# EAGLE design P2H2-001 (EAGLE 7.1.0)
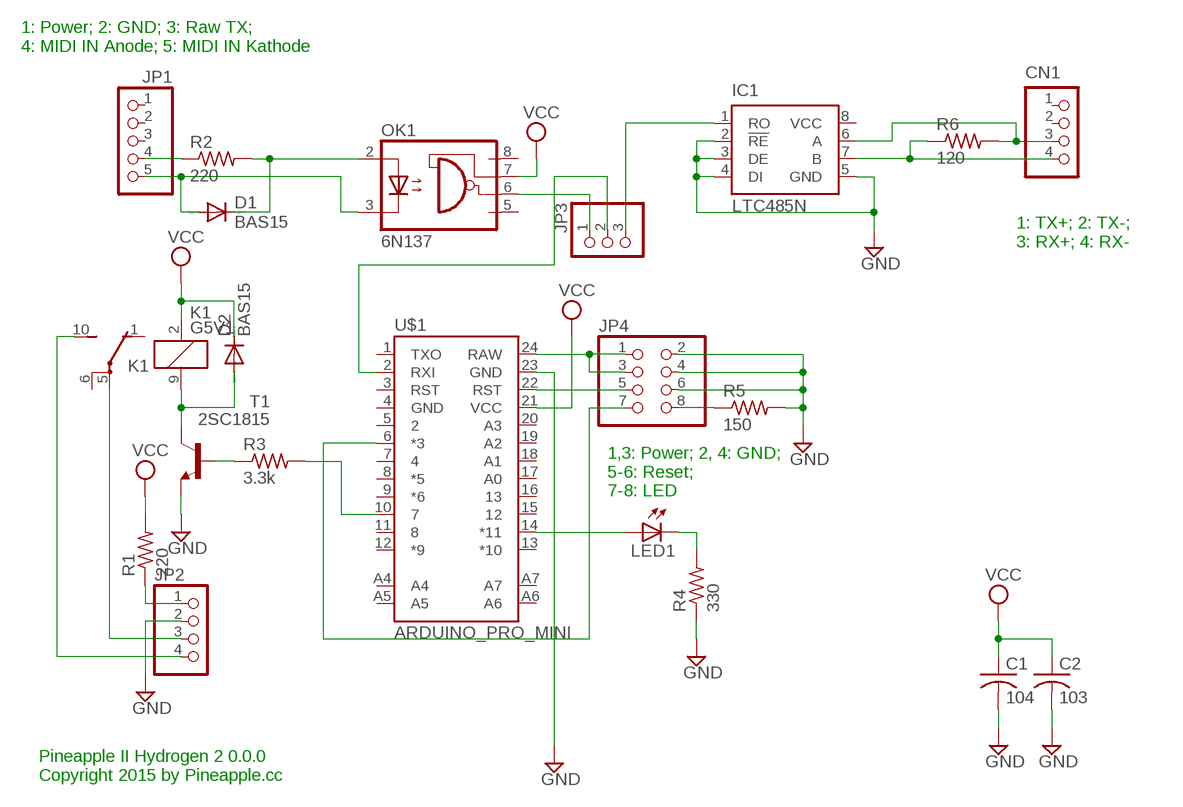
[diagram p0: schematic, sheet 1]

## Parts
C1  104  C-US025-025X050  [C025-025X050]
C2  103  C-US025-025X050  [C025-025X050]
CN1  B4B-PH-K-S  [B4B-PH-K-S]
D1  BAS15  [DO34-7]
D2  BAS15  [DO34-7]
IC1  LTC485N  [DIL08]
JP1  PINHD-1X5  [1X05]
JP2  PINHD-1X4  [1X04]
JP3  PINHD-1X3  [1X03]
JP4  PINHD-2X4  [2X04]
K1  G5V1  [G5V1]
LED1  LED3MM  [LED3MM]
OK1  6N137  [DIL08]
R1  220  R-US_0204/5  [0204/5]
R2  220  R-US_0204/5  [0204/5]
R3  3.3k  R-US_0204/5  [0204/5]
R4  330  R-US_0204/5  [0204/5]
R5  150  R-US_0204/5  [0204/5]
R6  120  R-US_0204/5  [0204/5]
T1  2SC1815  [TO92-ECB]
U$1  ARDUINO_PRO_MINI  [ARDUINO_PRO_MINI]

## Nets
GND: C1.2 C2.2 IC1.2(!RE) IC1.3(DE) IC1.4(DI) IC1.5(GND) JP2.2 JP4.2 JP4.4 JP4.6 R4.1 R5.2 T1.E U$1.23(GND)
N$1: R3.2 U$1.10
N$2: CN1.3 IC1.6(A) R6.2
N$3: JP1.4 R2.1
N$4: D1.C OK1.2(A) R2.2
N$5: JP4.8 R5.1
N$6: JP4.5 U$1.22(RST)
N$7: D1.A JP1.5 OK1.3(C)
N$8: JP4.7 U$1.6(*3)
N$9: JP4.1 JP4.3 U$1.24(RAW)
N$10: JP2.1 R1.1
N$11: CN1.4 IC1.7(B) R6.1
N$12: JP3.1 OK1.6(VO)
N$13: R3.1 T1.B
N$14: IC1.1(RO) JP3.3
N$15: D2.A K1.9 T1.C
N$16: LED1.A U$1.14(*11)
N$17: LED1.K(C) R4.2
N$18: JP2.3 K1.5(2:P)
N$19: JP2.4 K1.10(2:S)
N$20: JP3.2 U$1.2(RXI)
VCC: C1.1 C2.1 D2.C K1.2 OK1.7(VE) R1.2 U$1.21(VCC)
Unconnected: CN1.1 CN1.2 IC1.8(VCC) JP1.1 JP1.2 JP1.3 K1.1(2:O) K1.6(2:P) OK1.5(GND) OK1.8(VCC) U$1.1(TXO) U$1.3(RST) U$1.4(GND) U$1.5 U$1.7 U$1.8(*5) U$1.9(*6) U$1.11 U$1.12(*9) U$1.13(*10) U$1.15 U$1.16 U$1.17(A0) U$1.18(A1) U$1.19(A2) U$1.20(A3) U$1.A4 U$1.A5 U$1.A6 U$1.A7

## Notes on the sheet
- 1: Power; 2: GND; 3: Raw TX;
  4: MIDI IN Anode; 5: MIDI IN Kathode
- 1: TX+; 2: TX-;
  3: RX+; 4: RX-
- 1,3: Power; 2, 4: GND;
  5-6: Reset;
  7-8: LED
- Pineapple II Hydrogen 2 0.0.0
  Copyright 2015 by Pineapple.cc

## Library data of the parts
C1 C2 = rcl:C-US: CAPACITOR, American symbol
CN1 = jst-ph:B4B-PH-*: Wire-to-Board 2.0mm pitch top mount connector Source: http://www.jst-mfg.com/product/pdf/jpn/PH.pdf http://www.jst-mfg.com/product/detail.php?series=199
D1 D2 = diode:BAS15: DIODE high speed
IC1 = linear-technology:LTC485: Low Power RS485 Interface Transceiver Source: http://www.linear.com/pc/downloadDocument.do?navId=H0,C1,C1007,C1017,P2064,D1718; OC_FARNELL: unknown; OC_NEWARK: unknown
JP1 = pinhead:PINHD-1X5: PIN HEADER
JP2 = pinhead:PINHD-1X4: PIN HEADER
JP3 = pinhead:PINHD-1X3: PIN HEADER
JP4 = pinhead:PINHD-2X4: PIN HEADER
K1 = relay:G5V1: RELAY 1 x switch, 0.5 A/125 V AC, 1 A/24 V DC , Omron; MPN: G5V-1-DC24; OC_FARNELL: 9949593; OC_NEWARK: 36M6377
LED1 = led:LED: LED OSRAM: - CHIPLED LG R971, LG N971, LY N971, LG Q971, LY Q971, LO R971, LY R971 LH N974, LH R974 LS Q976, LO Q976, LY Q976 LO Q996 - Hyper CHIPLED LW Q18S LB Q993, LB Q99A, LB R99A - SideLED LS A670, LO A670, LY A670, LG A670, LP A670 LB A673, LV A673, LT A673, LW A673 LH A674 LY A675 LS A676, LA A676, LO A676, LY A676, LW A676 LS A679, LY A679, LG A679 - Hyper Micro SIDELED® LS Y876, LA Y876, LO Y876, LY Y876 LT Y87S - SmartLED LW L88C, LW L88S LB L89C, LB L89S, LG L890 LS L89K, LO L89K, LY L89K LS L896, LA L896, LO L896, LY L896 - TOPLED LS T670, LO T670, LY T670, LG T670, LP T670 LSG T670, LSP T670, LSY T670, LOP T670, LYG T670 LG T671, LOG T671, LSG T671 LB T673, LV T673, LT T673, LW T673 LH T674 LS T676, LA T676, LO T676, LY T676, LB T676, LH T676, LSB T676, LW T676 LB T67C, LV T67C, LT T67C, LS T67K, LO T67K, LY T67K, LW E67C LS E67B, LA E67B, LO E67B, LY E67B, LB E67C, LV E67C, LT E67C LW T67C LS T679, LY T679, LG T679 LS T770, LO T770, LY T770, LG T770, LP T770 LB T773, LV T773, LT T773, LW T773 LH T774 LS E675, LA E675, LY E675, LS T675 LS T776, LA T776, LO T776, LY T776, LB T776 LHGB T686 LT T68C, LB T68C - Hyper Mini TOPLED® LB M676 - Mini TOPLED Santana® LG M470 LS M47K, LO M47K, LY M47K Source: http://www.osram.convergy.de LUXEON: - LUMILED® LXK2-PW12-R00, LXK2-PW12-S00, LXK2-PW14-U00, LXK2-PW14-V00 LXK2-PM12-R00, LXK2-PM12-S00, LXK2-PM14-U00 LXK2-PE12-Q00, LXK2-PE12-R00, LXK2-PE12-S00, LXK2-PE14-T00, LXK2-PE14-U00 LXK2-PB12-K00, LXK2-PB12-L00, LXK2-PB12-M00, LXK2-PB14-N00, LXK2-PB14-P00, LXK2-PB14-Q00 LXK2-PR12-L00, LXK2-PR12-M00, LXK2-PR14-Q00, LXK2-PR14-R00 LXK2-PD12-Q00, LXK2-PD12-R00, LXK2-PD12-S00 LXK2-PH12-R00, LXK2-PH12-S00 LXK2-PL12-P00, LXK2-PL12-Q00, LXK2-PL12-R00 Source: www.luxeon.com KINGBRIGHT: KA-3528ASYC Source: www.kingbright.com
OK1 = optocoupler:6N137: MOTOROLA OPTO COUPLER; MPN: 6N137; OC_FARNELL: 1328376; OC_NEWARK: 52M1895
R1-R6 = resistor:R-US_: RESISTOR, American symbol
T1 = transistor:2SC1815: NPN EPITAXIAL TRANSISTOR Source: TOSHIBA .. 2SC1815 1.pdf
U$1 = SparkFun-Boards:ARDUINO_PRO_MINI

## Board
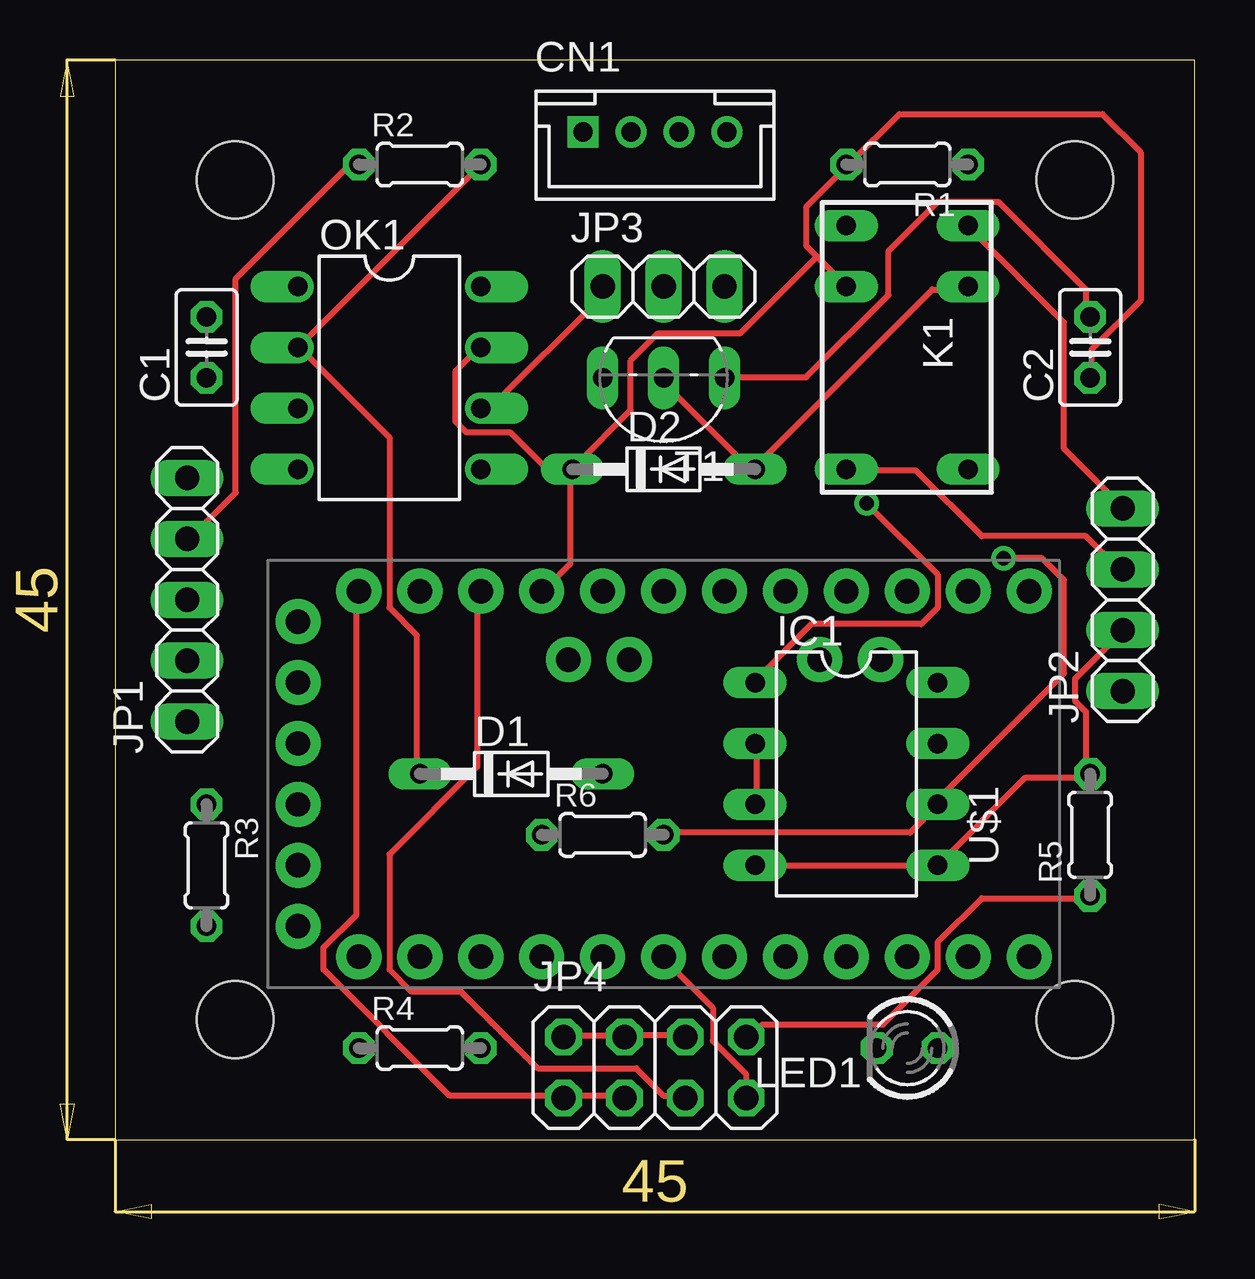
[diagram p1: board, top side]
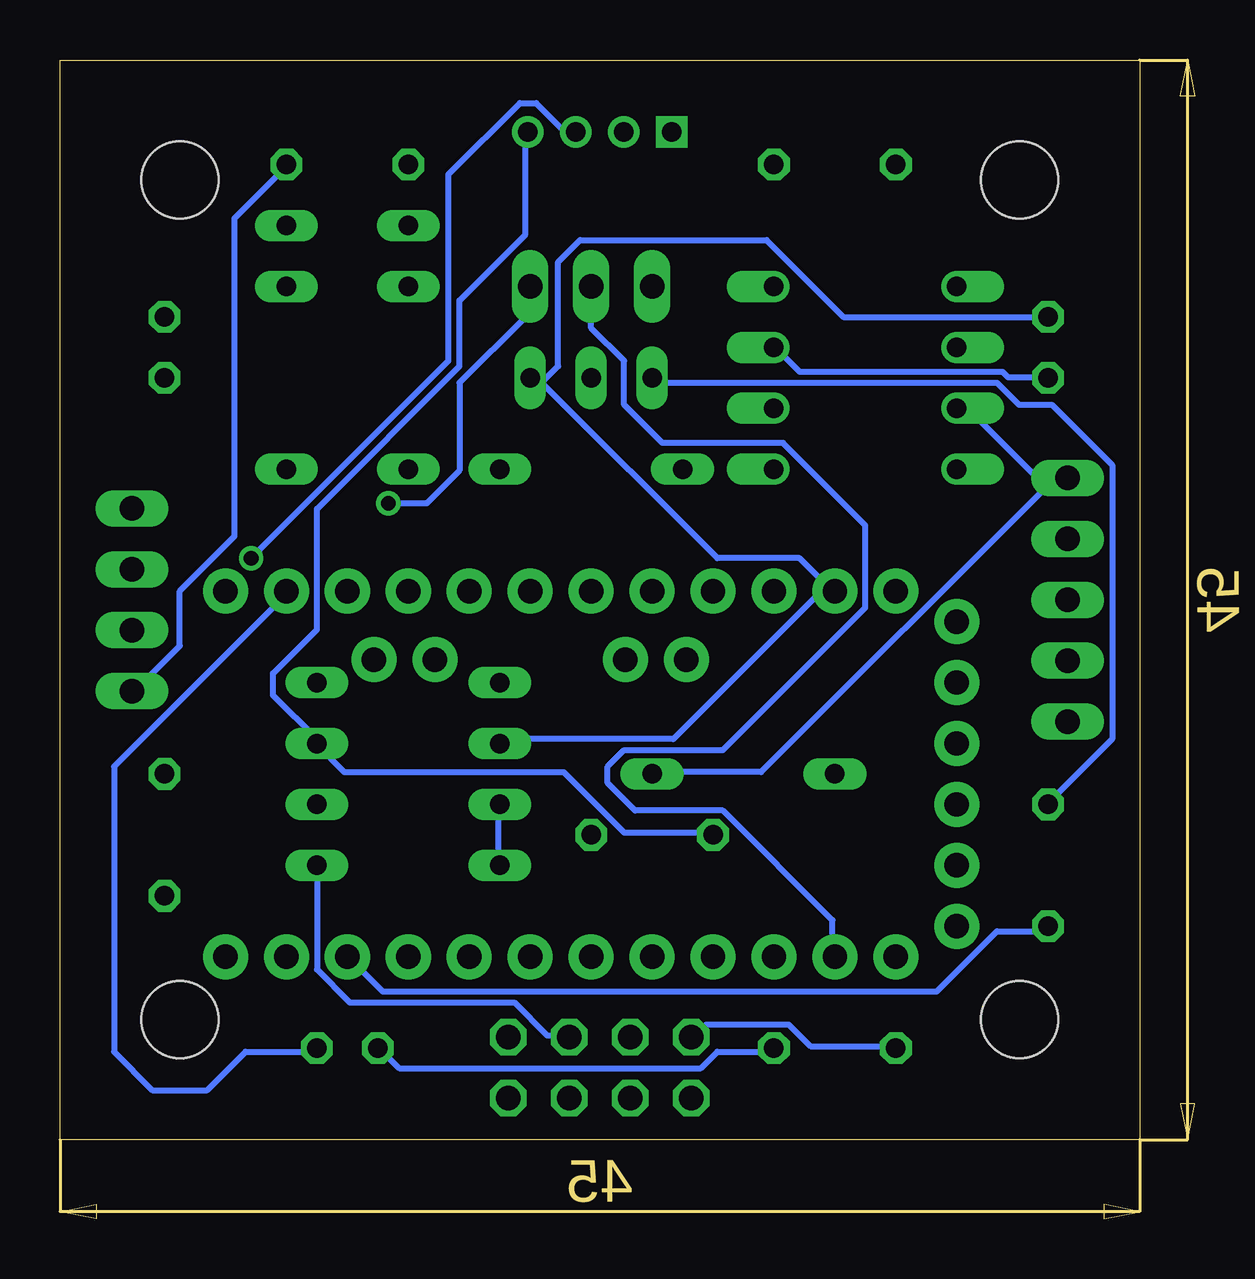
[diagram p2: board, bottom side, seen from below]

Size 45 x 45 mm. Coordinates in mm from the lower left corner, seen from the top.
Outline: 0,0 45,0 45,45 0,45 0,0
Copper layers (1*16): Top 0.035mm / dielectric 1.5mm / Bottom 0.035mm
Design rules "default": minimum track width 10mil, minimum drill 24mil, track to track 8mil, track to pad 8mil, pad to pad 8mil, via to via 8mil, smd to smd 8mil, copper to edge 40mil, drill to drill 8mil, minimum pad ring 10mil, minimum via ring 8mil, stop-mask expansion 4mil, vias tented up to drill 0mil, thermal gap 10mil
Holes 3.2 mm at 5,5 5,40 40,5 40,40

### Footprints (pad centres in the part's own frame; a part is rotated, then mirrored left to right if it is on the bottom)
C025-025X050 = drill 0.813 octagon: 1 -1.27,0; 2 1.27,0
B4B-PH-K-S = drill 0.8 square: 1 -3,0 | drill 0.8: 2 -1,0; 3 1,0; 4 3,0
DO34-7 = drill 0.813 long: A 3.81,0; C -3.81,0
DIL08 = drill 0.813 long: 1 -3.81,-3.81; 2 -1.27,-3.81; 3 1.27,-3.81; 4 3.81,-3.81; 5 3.81,3.81; 6 1.27,3.81; 7 -1.27,3.81; 8 -3.81,3.81
1X05 = drill 1.016 long: 1 -5.08,0; 2 -2.54,0; 3 0,0; 4 2.54,0; 5 5.08,0
1X04 = drill 1.016 long: 1 -3.81,0; 2 -1.27,0; 3 1.27,0; 4 3.81,0
1X03 = drill 1.016 long: 1 -2.54,0; 2 0,0; 3 2.54,0
2X04 = drill 1.016 octagon: 1 -3.81,-1.27; 2 -3.81,1.27; 3 -1.27,-1.27; 4 -1.27,1.27; 5 1.27,-1.27; 6 1.27,1.27; 7 3.81,-1.27; 8 3.81,1.27
G5V1 = drill 0.813 long: 1 -5.08,-2.54; 2 -2.54,-2.54; 5 5.08,-2.54; 6 5.08,2.54; 9 -2.54,2.54; 10 -5.08,2.54
LED3MM = drill 0.813 octagon: A -1.27,0; K 1.27,0
DIL08' = drill 0.813 offset: 1 -3.81,-3.81; 2 -1.27,-3.81; 3 1.27,-3.81; 4 3.81,-3.81; 5 3.81,3.81; 6 1.27,3.81; 7 -1.27,3.81; 8 -3.81,3.81
0204/5 = drill 0.813 octagon: 1 -2.54,0; 2 2.54,0
TO92-ECB = drill 0.813 long: B 2.54,0; C 0,0; E -2.54,0
ARDUINO_PRO_MINI = drill 1.016 pad 1.88: 1 -7.62,12.7; 2 -7.62,10.16; 3 -7.62,7.62; 4 -7.62,5.08; 5 -7.62,2.54; 6 -7.62,0; 7 -7.62,-2.54; 8 -7.62,-5.08; 9 -7.62,-7.62; 10 -7.62,-10.16; 11 -7.62,-12.7; 12 -7.62,-15.24; 13 7.62,-15.24; 14 7.62,-12.7; 15 7.62,-10.16; 16 7.62,-7.62; 17 7.62,-5.08; 18 7.62,-2.54; 19 7.62,0; 20 7.62,2.54; 21 7.62,5.08; 22 7.62,7.62; 23 7.62,10.16; 24 7.62,12.7; A4 4.763,1.429; A5 4.763,3.969; A6 4.763,-9.049; A7 4.763,-6.509; BLK -6.35,15.24; GND -3.81,15.24; GRN 6.35,15.24; RXI 1.27,15.24; TXO 3.81,15.24; VCC -1.27,15.24

### Placement (x,y rotation side)
C1  3.81,33.02 90 top
C2  40.64,33.02 90 top
CN1  22.5,42 0 top
D1  16.51,15.24 0 top
D2  22.86,27.94 0 top
IC1  30.48,15.24 270 top
JP1  3,22.5 90 top
JP2  42,22.5 90 top
JP3  22.86,35.56 0 top
JP4  22.5,3 0 top
K1  33.02,33.02 270 top
LED1  33.02,3.81 180 top
OK1  6N137  [DIL08']  11.43,31.75 270 top
R1  33.02,40.64 180 top
R2  12.7,40.64 0 top
R3  3.81,11.43 270 top
R4  12.7,3.81 0 top
R5  40.64,12.7 90 top
R6  20.32,12.7 0 top
T1  22.86,31.75 180 top
U$1  22.86,15.24 90 top

### Tracks (layer width: path | path; a pad name or v marks a point on that pad's centre or on a via)
GND
  Top 0.254: JP4.6 23.55,4.34 21.26,4.34 JP4.4 21.03,4.34 18.75,4.34 JP4.2 | JP2.2 41.83,21.03 40.01,19.2 40.01,18.29 40.46,17.83 40.46,15.32 R5.2 40.46,15.09 37.95,15.09 IC1.5 IC1.4 | IC1.2 26.75,16.46 26.75,14.17 IC1.3 | C2.2 40.46,34.29 40.46,35.43 36.8,39.09 34.29,39.09 32.23,37.03 32.23,35.2 28.8,31.77 25.6,31.77 T1.E
  Bottom 0.254: R4.1 10.29,3.89 13.72,3.89 14.63,4.8 18.06,4.8 18.52,4.34 JP4.2 | IC1.4 26.75,11.43 26.75,13.95 IC1.3 | IC1.5 34.29,7.09 32.92,5.71 26.06,5.71 24.69,4.34 23.77,4.34 JP4.6 | 24.92,31.55 25.38,31.55 T1.E 24.92,31.55 | 24.92,31.55 17.6,24.23 14.17,24.23 13.03,23.09 | 13.03,23.09 12.8,22.86 U$1.23 13.03,23.09 | C1.2 12.34,34.29 15.54,37.49 23.32,37.49 24.23,36.58 24.23,32.23 24.92,31.55 | 13.03,23.09 19.43,16.69 26.52,16.69 IC1.2
N$1
  Bottom 0.254: R3.2 3.89,8.69 5.94,8.69 8.46,6.17 31.55,6.17 32.92,7.54 U$1.10
N$2  (via drill 0.61)
  Top 0.254: v37.03,24.23 38.63,24.23 39.55,23.32 39.55,19.43 34.29,14.17 IC1.6 34.29,13.95 33.15,12.8 22.86,12.8 R6.2
  Bottom 0.254: v37.03,24.23 28.8,32.46 28.8,40.23 25.83,43.2 25.15,43.2 24,42.06 23.55,42.06 CN1.3
N$3
  Top 0.254: R2.1 10.06,40.46 9.6,40.46 5.03,35.89 5.03,26.98 3.2,25.15 JP1.4
N$4
  Top 0.254: R2.2 15.09,40.46 7.77,33.15 OK1.2 7.77,32.92 11.43,29.26 11.43,22.17 12.57,21.03 12.57,15.32 D1.C
N$5
  Top 0.254: R5.1 40.46,10.06 36.12,10.06 34.29,8.23 34.29,7.09 32,4.8 26.98,4.8 26.52,4.34 JP4.8
N$6
  Top 0.254: JP4.5 23.55,1.83 22.86,1.83 21.72,2.97 17.6,2.97 14.4,6.17 12.34,6.17 11.43,7.09 11.43,11.89 15.09,15.54 15.09,22.86 U$1.22
N$7
  Bottom 0.254: 3.89,27.2 3.66,27.43 3.2,27.43 JP1.5 3.89,27.2 | 3.89,27.2 15.77,15.32 20.12,15.32 D1.A | 3.89,27.2 7.09,30.4 7.54,30.4 OK1.3
N$8
  Top 0.254: JP4.7 26.29,1.83 26.29,2.74 24.92,4.12 24.92,5.49 22.86,7.54 U$1.6
N$9
  Top 0.254: JP4.3 21.03,1.83 18.75,1.83 JP4.1 18.52,1.83 13.95,1.83 8.69,7.09 8.69,8 10.06,9.37 10.06,22.86 U$1.24
N$10
  Bottom 0.254: R1.1 35.66,40.46 37.72,38.41 37.72,25.15 40.01,22.86 40.01,20.57 41.83,18.75 JP2.1
N$11
  Bottom 0.254: CN1.4 25.6,41.83 25.6,37.72 28.35,34.98 28.35,32.23 34.29,26.29 34.29,21.26 36.12,19.43 36.12,18.52 34.29,16.69 IC1.7 34.29,16.46 33.15,15.32 24,15.32 21.49,12.8 17.83,12.8 R6.1
N$12
  Top 0.254: OK1.6 15.32,30.63 15.77,30.63 20.12,34.98 20.12,35.43 JP3.1
N$13
  Bottom 0.254: R3.1 3.66,14.17 1.14,16.69 1.14,28.12 3.66,30.63 5.03,30.63 5.94,31.55 20.12,31.55 T1.B
N$14  (via drill 0.61)
  Top 0.254: v31.32,26.52 34.29,23.55 34.29,22.17 33.6,21.49 29.03,21.49 26.75,19.2 IC1.1
  Bottom 0.254: v31.32,26.52 29.72,26.52 28.35,27.89 28.35,31.55 25.6,34.29 25.6,35.43 JP3.3
N$15
  Top 0.254: T1.C 22.86,31.55 26.52,27.89 D2.A 26.75,28.12 34.06,35.43 35.43,35.43 K1.9
N$16
  Bottom 0.254: LED1.A 34.29,3.66 37.26,3.66 38.86,2.06 41.15,2.06 42.75,3.66 42.75,15.54 35.43,22.86 U$1.14
N$17
  Bottom 0.254: R4.2 15.32,3.66 17.6,3.66 18.29,2.97 30.86,2.97 31.55,3.66 LED1.K
N$18
  Top 0.254: K1.5 30.63,27.89 33.38,27.89 36.12,25.15 40.46,25.15 41.83,23.77 JP2.3
N$19
  Top 0.254: K1.10 35.66,37.95 39.55,34.06 39.55,28.8 41.83,26.52 JP2.4
N$20
  Bottom 0.254: JP3.2 22.86,33.83 21.49,32.46 21.49,30.63 19.89,29.03 14.86,29.03 11.43,25.6 11.43,22.17 17.37,16.23 21.49,16.23 22.17,15.54 22.17,14.86 21.03,13.72 17.37,13.72 12.8,9.14 12.8,7.77 U$1.2
VCC
  Top 0.254: 29.26,36.8 28.8,37.26 28.8,38.86 30.4,40.46 R1.2 30.63,40.69 32.69,42.75 41.15,42.75 42.75,41.15 42.75,34.98 40.69,32.92 40.69,31.77 C2.1 | 29.26,36.8 30.4,35.66 K1.2 | D2.C 18.97,27.89 18.97,24 17.83,22.86 U$1.21 | D2.C 18.97,28.12 17.83,28.12 16.46,29.49 14.63,29.49 14.17,29.95 14.17,32 15.09,32.92 OK1.7 | 29.26,36.8 26.06,33.6 22.63,33.6 21.49,32.46 21.49,30.4 19.2,28.12 D2.C
  Bottom 0.254: C1.1 3.89,31.77 5.49,31.77 5.71,32 14.17,32 15.09,32.92 OK1.7